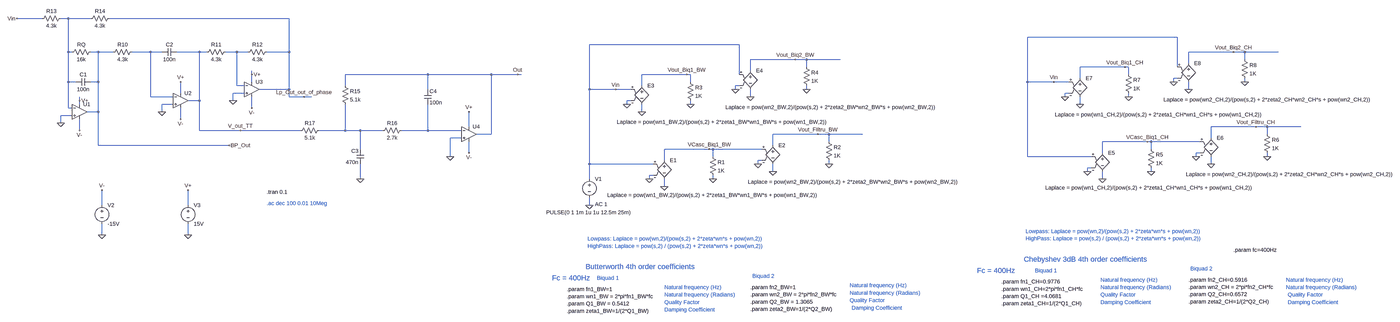
[diagram p0: schematic Laplace_Biquad_TJ_Comp_Chebyseb_025_practic.asc, whole sheet]
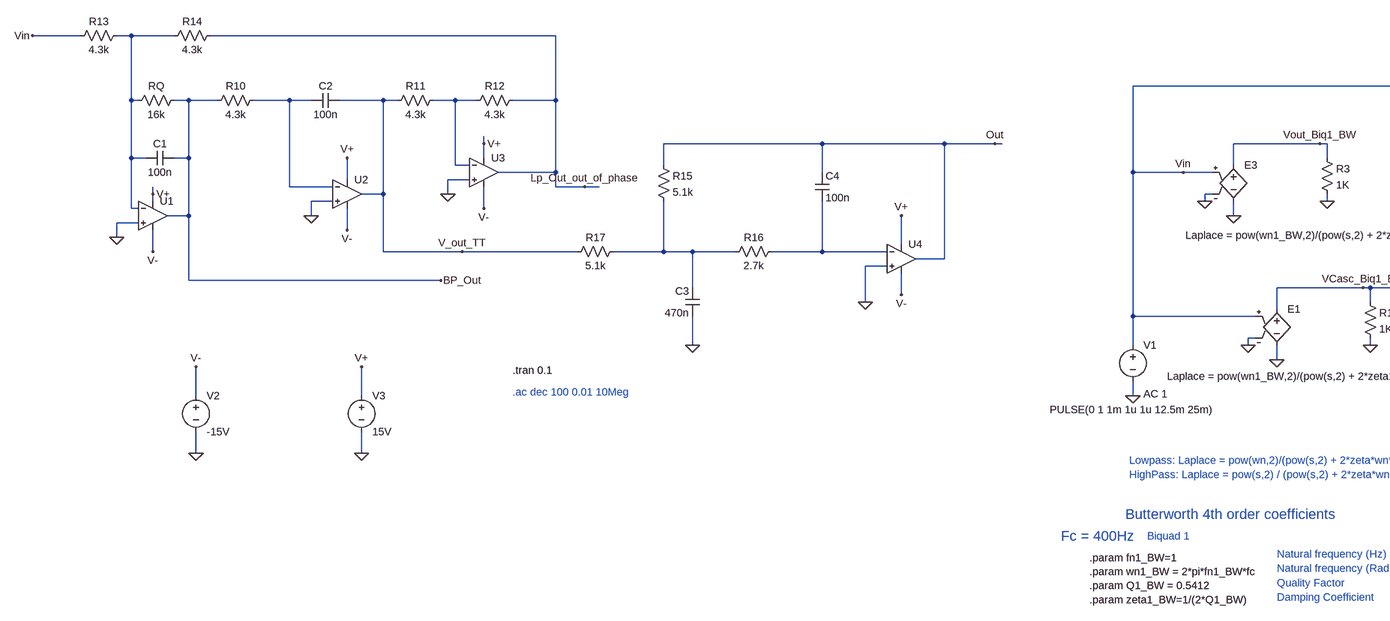
[diagram p1: schematic Laplace_Biquad_TJ_Comp_Chebyseb_025_practic.asc, part, row 1 of 1, column 1 of 2]
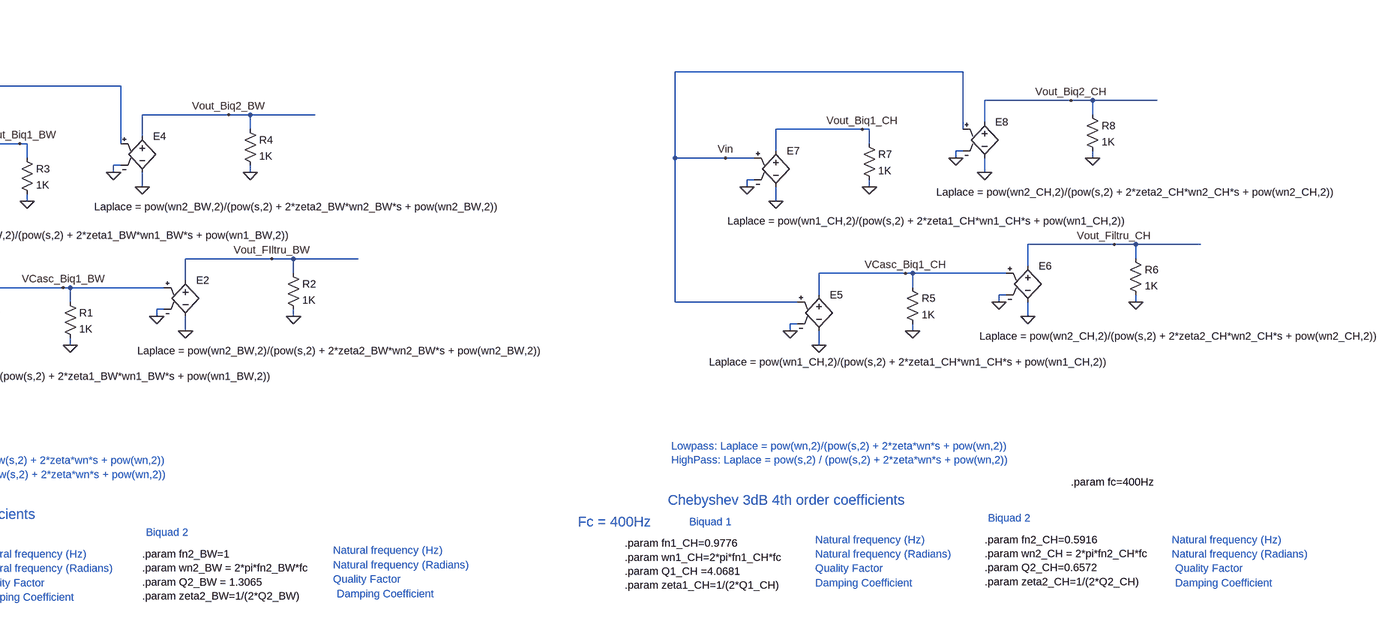
[diagram p2: schematic Laplace_Biquad_TJ_Comp_Chebyseb_025_practic.asc, part, row 1 of 1, column 2 of 2]
Laplace_Biquad_TJ_Comp_Chebyseb_025_practic.asc, the LTspice schematic file:
Version 4.1
SHEET 1 3484 812
WIRE -3120 -576 -3264 -576
WIRE -3008 -576 -3040 -576
WIRE -2912 -576 -3008 -576
WIRE -2064 -576 -2832 -576
WIRE 2464 -496 1824 -496
WIRE 592 -464 -48 -464
WIRE -3008 -432 -3008 -576
WIRE -2992 -432 -3008 -432
WIRE -2880 -432 -2912 -432
WIRE -2816 -432 -2880 -432
WIRE -2656 -432 -2736 -432
WIRE -2608 -432 -2656 -432
WIRE -2448 -432 -2544 -432
WIRE -2416 -432 -2448 -432
WIRE -2288 -432 -2336 -432
WIRE -2240 -432 -2288 -432
WIRE -2064 -432 -2064 -576
WIRE -2064 -432 -2160 -432
WIRE 2704 -432 2512 -432
WIRE 2752 -432 2704 -432
WIRE 2896 -432 2752 -432
WIRE 832 -400 640 -400
WIRE 880 -400 832 -400
WIRE 1024 -400 880 -400
WIRE 2752 -400 2752 -432
WIRE 2512 -384 2512 -432
WIRE 880 -368 880 -400
WIRE 2240 -368 2048 -368
WIRE 2256 -368 2240 -368
WIRE 2464 -368 2464 -496
WIRE 640 -352 640 -400
WIRE -2224 -336 -2224 -352
WIRE -1472 -336 -1824 -336
WIRE -1200 -336 -1472 -336
WIRE -1088 -336 -1200 -336
WIRE -1072 -336 -1088 -336
WIRE 368 -336 176 -336
WIRE 384 -336 368 -336
WIRE 592 -336 592 -464
WIRE 2256 -336 2256 -368
WIRE 2048 -320 2048 -368
WIRE 2464 -320 2448 -320
WIRE -3008 -304 -3008 -432
WIRE -2976 -304 -3008 -304
WIRE -2880 -304 -2880 -432
WIRE -2880 -304 -2912 -304
WIRE -2224 -304 -2224 -336
WIRE 384 -304 384 -336
WIRE 1824 -304 1824 -496
WIRE 1936 -304 1824 -304
WIRE 2000 -304 1936 -304
WIRE 2448 -304 2448 -320
WIRE 2752 -304 2752 -320
WIRE -2288 -288 -2288 -432
WIRE -2256 -288 -2288 -288
WIRE -1824 -288 -1824 -336
WIRE 176 -288 176 -336
WIRE 592 -288 576 -288
WIRE -2064 -272 -2064 -432
WIRE -2064 -272 -2192 -272
WIRE -1472 -272 -1472 -336
WIRE -48 -272 -48 -464
WIRE 64 -272 -48 -272
WIRE 128 -272 64 -272
WIRE 576 -272 576 -288
WIRE 880 -272 880 -288
WIRE 2512 -272 2512 -304
WIRE -2528 -256 -2528 -304
WIRE -2256 -256 -2304 -256
WIRE 2000 -256 1984 -256
WIRE -2656 -240 -2656 -432
WIRE -2560 -240 -2656 -240
WIRE -2064 -240 -2064 -272
WIRE -2000 -240 -2064 -240
WIRE -1968 -240 -2000 -240
WIRE 640 -240 640 -272
WIRE 1984 -240 1984 -256
WIRE 2256 -240 2256 -256
WIRE -2960 -224 -2960 -240
WIRE -2448 -224 -2448 -432
WIRE -2448 -224 -2496 -224
WIRE -2304 -224 -2304 -256
WIRE 128 -224 112 -224
WIRE -2960 -208 -2960 -224
WIRE -2560 -208 -2608 -208
WIRE 112 -208 112 -224
WIRE 384 -208 384 -224
WIRE 2048 -208 2048 -240
WIRE -3008 -192 -3008 -304
WIRE -2992 -192 -3008 -192
WIRE -2224 -192 -2224 -240
WIRE -2880 -176 -2880 -304
WIRE -2880 -176 -2928 -176
WIRE -2608 -176 -2608 -208
WIRE 176 -176 176 -208
WIRE -2992 -160 -3040 -160
WIRE -2528 -144 -2528 -192
WIRE -3040 -128 -3040 -160
WIRE -1296 -112 -1296 -176
WIRE 2800 -112 2608 -112
WIRE 2848 -112 2800 -112
WIRE 2992 -112 2848 -112
WIRE -2960 -96 -2960 -144
WIRE -2448 -96 -2448 -224
WIRE -2272 -96 -2448 -96
WIRE -2016 -96 -2272 -96
WIRE -1824 -96 -1824 -208
WIRE -1824 -96 -1936 -96
WIRE -1760 -96 -1824 -96
WIRE -1664 -96 -1760 -96
WIRE -1472 -96 -1472 -208
WIRE -1472 -96 -1584 -96
WIRE -1328 -96 -1472 -96
WIRE -1200 -80 -1200 -336
WIRE -1200 -80 -1264 -80
WIRE 928 -80 736 -80
WIRE 976 -80 928 -80
WIRE 1120 -80 976 -80
WIRE 2848 -80 2848 -112
WIRE -1328 -64 -1376 -64
WIRE 2608 -64 2608 -112
WIRE 976 -48 976 -80
WIRE 2336 -48 2144 -48
WIRE 2352 -48 2336 -48
WIRE 2560 -48 2352 -48
WIRE -2880 -32 -2880 -176
WIRE -2320 -32 -2880 -32
WIRE 736 -32 736 -80
WIRE -1760 -16 -1760 -96
WIRE 464 -16 272 -16
WIRE 480 -16 464 -16
WIRE 688 -16 480 -16
WIRE 2352 -16 2352 -48
WIRE -1296 0 -1296 -48
WIRE 2144 0 2144 -48
WIRE 2560 0 2544 0
WIRE -1376 16 -1376 -64
WIRE 480 16 480 -16
WIRE 1824 16 1824 -304
WIRE 2096 16 1824 16
WIRE 2544 16 2544 0
WIRE 2848 16 2848 0
WIRE 272 32 272 -16
WIRE 688 32 672 32
WIRE -48 48 -48 -272
WIRE 224 48 -48 48
WIRE 672 48 672 32
WIRE 976 48 976 32
WIRE 2608 48 2608 16
WIRE 2096 64 2080 64
WIRE 736 80 736 48
WIRE 2080 80 2080 64
WIRE 2352 80 2352 64
WIRE 224 96 208 96
WIRE -1760 112 -1760 48
WIRE -48 112 -48 48
WIRE 208 112 208 96
WIRE 480 112 480 96
WIRE 2144 112 2144 80
WIRE 272 144 272 112
WIRE -2864 224 -2864 160
WIRE -2496 224 -2496 160
WIRE -48 224 -48 192
WIRE -2864 352 -2864 304
WIRE -2496 352 -2496 304
FLAG -48 224 0
FLAG 208 112 0
FLAG 272 144 0
FLAG 464 -16 VCasc_Biq1_BW
FLAG 672 48 0
FLAG 736 80 0
FLAG 928 -80 Vout_FIltru_BW
FLAG 480 112 0
FLAG 976 48 0
FLAG 64 -272 Vin
FLAG 112 -208 0
FLAG 176 -176 0
FLAG 368 -336 Vout_Biq1_BW
FLAG 576 -272 0
FLAG 640 -240 0
FLAG 832 -400 Vout_Biq2_BW
FLAG 384 -208 0
FLAG 880 -272 0
FLAG 2080 80 0
FLAG 2144 112 0
FLAG 2336 -48 VCasc_Biq1_CH
FLAG 2544 16 0
FLAG 2608 48 0
FLAG 2800 -112 Vout_Filtru_CH
FLAG 2352 80 0
FLAG 2848 16 0
FLAG 1936 -304 Vin
FLAG 1984 -240 0
FLAG 2048 -208 0
FLAG 2240 -368 Vout_Biq1_CH
FLAG 2448 -304 0
FLAG 2512 -272 0
FLAG 2704 -432 Vout_Biq2_CH
FLAG 2256 -240 0
FLAG 2752 -304 0
FLAG -2608 -176 0
FLAG -2304 -224 0
FLAG -1376 16 0
FLAG -1760 112 0
FLAG -1088 -336 Out
FLAG -2000 -240 Lp_Out_out_of_phase
FLAG -2320 -32 BP_Out
FLAG -2864 352 0
FLAG -2496 352 0
FLAG -2496 160 V+
FLAG -2864 160 V-
FLAG -3264 -576 Vin
FLAG -1296 -176 V+
FLAG -2224 -336 V+
FLAG -2528 -304 V+
FLAG -2960 -224 V+
FLAG -1296 0 V-
FLAG -2224 -192 V-
FLAG -2528 -144 V-
FLAG -2960 -96 V-
FLAG -3040 -128 0
FLAG -2272 -96 V_out_TT
SYMBOL voltage -48 96 R0
WINDOW 123 24 124 Left 2
WINDOW 39 0 0 Left 2
WINDOW 3 -185 159 Left 2
SYMATTR Value2 AC 1
SYMATTR Value PULSE(0 1 1m 1u 1u 12.5m 25m)
SYMATTR InstName V1
SYMBOL e 272 16 R0
WINDOW 3 -244 165 Left 2
SYMATTR Value Laplace = pow(wn1_BW,2)/(pow(s,2) + 2*zeta1_BW*wn1_BW*s + pow(wn1_BW,2))
SYMATTR InstName E1
SYMBOL e 736 -48 R0
WINDOW 3 -107 172 Left 2
SYMATTR Value Laplace = pow(wn2_BW,2)/(pow(s,2) + 2*zeta2_BW*wn2_BW*s + pow(wn2_BW,2))
SYMATTR InstName E2
SYMBOL res 464 0 R0
SYMATTR InstName R1
SYMATTR Value 1K
SYMBOL res 960 -64 R0
SYMATTR InstName R2
SYMATTR Value 1K
SYMBOL e 176 -304 R0
WINDOW 3 -107 172 Left 2
SYMATTR Value Laplace = pow(wn1_BW,2)/(pow(s,2) + 2*zeta1_BW*wn1_BW*s + pow(wn1_BW,2))
SYMATTR InstName E3
SYMBOL e 640 -368 R0
WINDOW 3 -107 172 Left 2
SYMATTR Value Laplace = pow(wn2_BW,2)/(pow(s,2) + 2*zeta2_BW*wn2_BW*s + pow(wn2_BW,2))
SYMATTR InstName E4
SYMBOL res 368 -320 R0
SYMATTR InstName R3
SYMATTR Value 1K
SYMBOL res 864 -384 R0
SYMATTR InstName R4
SYMATTR Value 1K
SYMBOL e 2144 -16 R0
WINDOW 3 -244 165 Left 2
SYMATTR Value Laplace = pow(wn1_CH,2)/(pow(s,2) + 2*zeta1_CH*wn1_CH*s + pow(wn1_CH,2))
SYMATTR InstName E5
SYMBOL e 2608 -80 R0
WINDOW 3 -107 172 Left 2
SYMATTR Value Laplace = pow(wn2_CH,2)/(pow(s,2) + 2*zeta2_CH*wn2_CH*s + pow(wn2_CH,2))
SYMATTR InstName E6
SYMBOL res 2336 -32 R0
SYMATTR InstName R5
SYMATTR Value 1K
SYMBOL res 2832 -96 R0
SYMATTR InstName R6
SYMATTR Value 1K
SYMBOL e 2048 -336 R0
WINDOW 3 -107 172 Left 2
SYMATTR Value Laplace = pow(wn1_CH,2)/(pow(s,2) + 2*zeta1_CH*wn1_CH*s + pow(wn1_CH,2))
SYMATTR InstName E7
SYMBOL e 2512 -400 R0
WINDOW 3 -107 172 Left 2
SYMATTR Value Laplace = pow(wn2_CH,2)/(pow(s,2) + 2*zeta2_CH*wn2_CH*s + pow(wn2_CH,2))
SYMATTR InstName E8
SYMBOL res 2240 -352 R0
SYMATTR InstName R7
SYMATTR Value 1K
SYMBOL res 2736 -416 R0
SYMATTR InstName R8
SYMATTR Value 1K
SYMBOL OpAmps\\UniversalOpAmp2 -2960 -176 R0
SYMATTR InstName U1
SYMBOL OpAmps\\UniversalOpAmp2 -2224 -272 R0
SYMATTR InstName U3
SYMBOL res -2896 -448 R90
WINDOW 0 0 56 VBottom 2
WINDOW 3 32 56 VTop 2
SYMATTR InstName RQ
SYMATTR Value 16k
SYMBOL res -2720 -448 R90
WINDOW 0 0 56 VBottom 2
WINDOW 3 32 56 VTop 2
SYMATTR InstName R10
SYMATTR Value 4.3k
SYMBOL res -2320 -448 R90
WINDOW 0 0 56 VBottom 2
WINDOW 3 32 56 VTop 2
SYMATTR InstName R11
SYMATTR Value 4.3k
SYMBOL res -2144 -448 R90
WINDOW 0 0 56 VBottom 2
WINDOW 3 32 56 VTop 2
SYMATTR InstName R12
SYMATTR Value 4.3k
SYMBOL res -3024 -592 R90
WINDOW 0 0 56 VBottom 2
WINDOW 3 32 56 VTop 2
SYMATTR InstName R13
SYMATTR Value 4.3k
SYMBOL res -2816 -592 R90
WINDOW 0 0 56 VBottom 2
WINDOW 3 32 56 VTop 2
SYMATTR InstName R14
SYMATTR Value 4.3k
SYMBOL cap -2912 -320 R90
WINDOW 0 0 32 VBottom 2
WINDOW 3 32 32 VTop 2
SYMATTR InstName C1
SYMATTR Value 100n
SYMBOL cap -2544 -448 R90
WINDOW 0 0 32 VBottom 2
WINDOW 3 32 32 VTop 2
SYMATTR InstName C2
SYMATTR Value 100n
SYMBOL res -1840 -304 R0
SYMATTR InstName R15
SYMATTR Value 5.1k
SYMBOL res -1568 -112 R90
WINDOW 0 0 56 VBottom 2
WINDOW 3 32 56 VTop 2
SYMATTR InstName R16
SYMATTR Value 2.7k
SYMBOL cap -1744 48 R180
WINDOW 0 24 56 Left 2
WINDOW 3 24 8 Left 2
SYMATTR InstName C3
SYMATTR Value 470n
SYMBOL cap -1488 -272 R0
SYMATTR InstName C4
SYMATTR Value 100n
SYMBOL OpAmps\\UniversalOpAmp2 -1296 -80 R0
SYMATTR InstName U4
SYMBOL res -1920 -112 R90
WINDOW 0 0 56 VBottom 2
WINDOW 3 32 56 VTop 2
SYMATTR InstName R17
SYMATTR Value 5.1k
SYMBOL voltage -2864 208 R0
WINDOW 123 0 0 Left 0
WINDOW 39 0 0 Left 0
SYMATTR InstName V2
SYMATTR Value -15V
SYMBOL voltage -2496 208 R0
WINDOW 123 0 0 Left 0
WINDOW 39 0 0 Left 0
SYMATTR InstName V3
SYMATTR Value 15V
SYMBOL OpAmps\\UniversalOpAmp2 -2528 -224 R0
SYMATTR InstName U2
TEXT -144 584 Left 2 !.param fn1_BW=1\n.param wn1_BW = 2*pi*fn1_BW*fc\n.param Q1_BW = 0.5412\n.param zeta1_BW=1/(2*Q1_BW)
TEXT -2160 216 Left 2 ;.ac dec 100 0.01 10Meg
TEXT 272 576 Left 2 ;Natural frequency (Hz)
TEXT 272 608 Left 2 ;Natural frequency (Radians)
TEXT 272 672 Left 2 ;Damping Coefficient
TEXT -16 536 Left 2 ;Biquad 1
TEXT -56 368 Left 2 ;Lowpass: Laplace = pow(wn,2)/(pow(s,2) + 2*zeta*wn*s + pow(wn,2))\nHighPass: Laplace = pow(s,2) / (pow(s,2) + 2*zeta*wn*s + pow(wn,2))
TEXT 640 576 Left 2 !.param fn2_BW=1\n.param wn2_BW = 2*pi*fn2_BW*fc\n.param Q2_BW = 1.3065\n.param zeta2_BW=1/(2*Q2_BW)
TEXT 1064 568 Left 2 ;Natural frequency (Hz)
TEXT 1064 600 Left 2 ;Natural frequency (Radians)
TEXT 1072 664 Left 2 ;Damping Coefficient
TEXT 272 640 Left 2 ;Quality Factor
TEXT 1064 632 Left 2 ;Quality Factor
TEXT -64 488 Left 3 ;Butterworth 4th order coefficients
TEXT 648 528 Left 2 ;Biquad 2
TEXT 1712 552 Left 2 !.param fn1_CH=0.9776\n.param wn1_CH=2*pi*fn1_CH*fc\n.param Q1_CH =4.0681\n.param zeta1_CH=1/(2*Q1_CH)
TEXT 2136 544 Left 2 ;Natural frequency (Hz)
TEXT 2136 576 Left 2 ;Natural frequency (Radians)
TEXT 2136 640 Left 2 ;Damping Coefficient
TEXT 1856 504 Left 2 ;Biquad 1
TEXT 1816 336 Left 2 ;Lowpass: Laplace = pow(wn,2)/(pow(s,2) + 2*zeta*wn*s + pow(wn,2))\nHighPass: Laplace = pow(s,2) / (pow(s,2) + 2*zeta*wn*s + pow(wn,2))
TEXT 2512 544 Left 2 !.param fn2_CH=0.5916\n.param wn2_CH = 2*pi*fn2_CH*fc\n.param Q2_CH=0.6572\n.param zeta2_CH=1/(2*Q2_CH)
TEXT 2928 544 Left 2 ;Natural frequency (Hz)
TEXT 2928 576 Left 2 ;Natural frequency (Radians)
TEXT 2936 640 Left 2 ;Damping Coefficient
TEXT 2136 608 Left 2 ;Quality Factor
TEXT 2936 608 Left 2 ;Quality Factor
TEXT 1808 456 Left 3 ;Chebyshev 3dB 4th order coefficients
TEXT 2520 496 Left 2 ;Biquad 2
TEXT 1608 504 Left 3 ;Fc = 400Hz
TEXT -208 536 Left 3 ;Fc = 400Hz
TEXT 2704 416 Left 2 !.param fc=400Hz
TEXT -2160 168 Left 2 !.tran 0.1

The netlist it stands for:
* Laplace_Biquad_TJ_Comp_Chebyseb_025_practic.asc
V1 Vin 0 PULSE(0 1 1m 1u 1u 12.5m 25m) AC 1
E1 VCasc_Biq1_BW 0 Vin 0 Laplace = pow(wn1_BW,2)/(pow(s,2) + 2*zeta1_BW*wn1_BW*s + pow(wn1_BW,2))
E2 Vout_FIltru_BW 0 VCasc_Biq1_BW 0 Laplace = pow(wn2_BW,2)/(pow(s,2) + 2*zeta2_BW*wn2_BW*s + pow(wn2_BW,2))
R1 VCasc_Biq1_BW 0 1K
R2 Vout_FIltru_BW 0 1K
E3 Vout_Biq1_BW 0 Vin 0 Laplace = pow(wn1_BW,2)/(pow(s,2) + 2*zeta1_BW*wn1_BW*s + pow(wn1_BW,2))
E4 Vout_Biq2_BW 0 Vin 0 Laplace = pow(wn2_BW,2)/(pow(s,2) + 2*zeta2_BW*wn2_BW*s + pow(wn2_BW,2))
R3 Vout_Biq1_BW 0 1K
R4 Vout_Biq2_BW 0 1K
E5 VCasc_Biq1_CH 0 Vin 0 Laplace = pow(wn1_CH,2)/(pow(s,2) + 2*zeta1_CH*wn1_CH*s + pow(wn1_CH,2))
E6 Vout_Filtru_CH 0 VCasc_Biq1_CH 0 Laplace = pow(wn2_CH,2)/(pow(s,2) + 2*zeta2_CH*wn2_CH*s + pow(wn2_CH,2))
R5 VCasc_Biq1_CH 0 1K
R6 Vout_Filtru_CH 0 1K
E7 Vout_Biq1_CH 0 Vin 0 Laplace = pow(wn1_CH,2)/(pow(s,2) + 2*zeta1_CH*wn1_CH*s + pow(wn1_CH,2))
E8 Vout_Biq2_CH 0 Vin 0 Laplace = pow(wn2_CH,2)/(pow(s,2) + 2*zeta2_CH*wn2_CH*s + pow(wn2_CH,2))
R7 Vout_Biq1_CH 0 1K
R8 Vout_Biq2_CH 0 1K
X§U1 0 N001 V+ V- BP_Out level2 Avol=1Meg GBW=10Meg Slew=10Meg Ilimit=25m Rail=0 Vos=0 En=0 Enk=0 In=0 Ink=0 Rin=500Meg  ; pins In+ In- V+ V- OUT
X§U3 0 N003 V+ V- Lp_Out_out_of_phase level2 Avol=1Meg GBW=10Meg Slew=10Meg Ilimit=25m Rail=0 Vos=0 En=0 Enk=0 In=0 Ink=0 Rin=500Meg  ; pins In+ In- V+ V- OUT
RQ BP_Out N001 16k
R10 N002 BP_Out 4.3k
R11 N003 V_out_TT 4.3k
R12 Lp_Out_out_of_phase N003 4.3k
R13 N001 Vin 4.3k
R14 Lp_Out_out_of_phase N001 4.3k
C1 BP_Out N001 100n
C2 V_out_TT N002 100n
R15 Out N004 5.1k
R16 N005 N004 2.7k
C3 0 N004 470n
C4 Out N005 100n
X§U4 0 N005 V+ V- Out level2 Avol=1Meg GBW=10Meg Slew=10Meg Ilimit=25m Rail=0 Vos=0 En=0 Enk=0 In=0 Ink=0 Rin=500Meg  ; pins In+ In- V+ V- OUT
R17 N004 V_out_TT 5.1k
V2 V- 0 -15V
V3 V+ 0 15V
X§U2 0 N002 V+ V- V_out_TT level2 Avol=1Meg GBW=10Meg Slew=10Meg Ilimit=25m Rail=0 Vos=0 En=0 Enk=0 In=0 Ink=0 Rin=500Meg  ; pins In+ In- V+ V- OUT
.param fn1_BW=1
.param wn1_BW = 2*pi*fn1_BW*fc
.param Q1_BW = 0.5412
.param zeta1_BW=1/(2*Q1_BW)
* .ac dec 100 0.01 10Meg
* Natural frequency (Hz)
* Natural frequency (Radians)
* Damping Coefficient
* Biquad 1
* Lowpass: Laplace = pow(wn,2)/(pow(s,2) + 2*zeta*wn*s + pow(wn,2))
* HighPass: Laplace = pow(s,2) / (pow(s,2) + 2*zeta*wn*s + pow(wn,2))
.param fn2_BW=1
.param wn2_BW = 2*pi*fn2_BW*fc
.param Q2_BW = 1.3065
.param zeta2_BW=1/(2*Q2_BW)
* Natural frequency (Hz)
* Natural frequency (Radians)
* Damping Coefficient
* Quality Factor
* Quality Factor
* Butterworth 4th order coefficients
* Biquad 2
.param fn1_CH=0.9776
.param wn1_CH=2*pi*fn1_CH*fc
.param Q1_CH =4.0681
.param zeta1_CH=1/(2*Q1_CH)
* Natural frequency (Hz)
* Natural frequency (Radians)
* Damping Coefficient
* Biquad 1
* Lowpass: Laplace = pow(wn,2)/(pow(s,2) + 2*zeta*wn*s + pow(wn,2))
* HighPass: Laplace = pow(s,2) / (pow(s,2) + 2*zeta*wn*s + pow(wn,2))
.param fn2_CH=0.5916
.param wn2_CH = 2*pi*fn2_CH*fc
.param Q2_CH=0.6572
.param zeta2_CH=1/(2*Q2_CH)
* Natural frequency (Hz)
* Natural frequency (Radians)
* Damping Coefficient
* Quality Factor
* Quality Factor
* Chebyshev 3dB 4th order coefficients
* Biquad 2
* Fc = 400Hz
* Fc = 400Hz
.param fc=400Hz
.tran 0.1
.lib UniversalOpAmp2.lib
.backanno
.end